# Altium schematic sheet 03.main.SchDoc
size A4
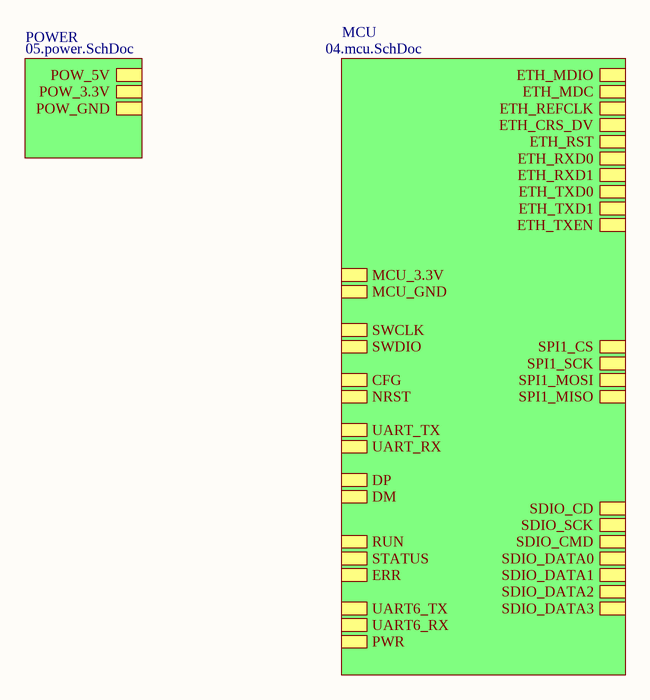
[diagram p0: 03.main.SchDoc]

## Sub-sheets
MCU = 04.mcu.SchDoc: SPI1_CS, SPI1_SCK, SPI1_MOSI, SPI1_MISO, SWCLK, SWDIO, CFG, NRST, DP, DM, UART_TX, UART_RX, SDIO_CD, SDIO_SCK, SDIO_CMD, SDIO_DATA0, SDIO_DATA1, SDIO_DATA2, SDIO_DATA3, RUN, ERR, STATUS, MCU_3.3V, MCU_GND, ETH_MDIO, ETH_MDC, ETH_CRS_DV, ETH_RST, ETH_RXD0, ETH_RXD1, ETH_TXD0, ETH_TXD1, ETH_TXEN, ETH_REFCLK, UART6_TX, UART6_RX, PWR
POWER = 05.power.SchDoc: POW_5V, POW_3.3V, POW_GND

## Notes on the sheet
- #
- 日期
- 描述
- DESIGN BY
- 设计人员
- 设计日期
- 图纸名称
- 图纸描述
- EasyLinker Develop Team
- 审核人员
- 审核日期
- 产品名称
- 产品型号
- 图纸版本
- /
- A4